# EAGLE design Ali CC Regolabile OpAmp(NPN) (EAGLE 7.2.0)
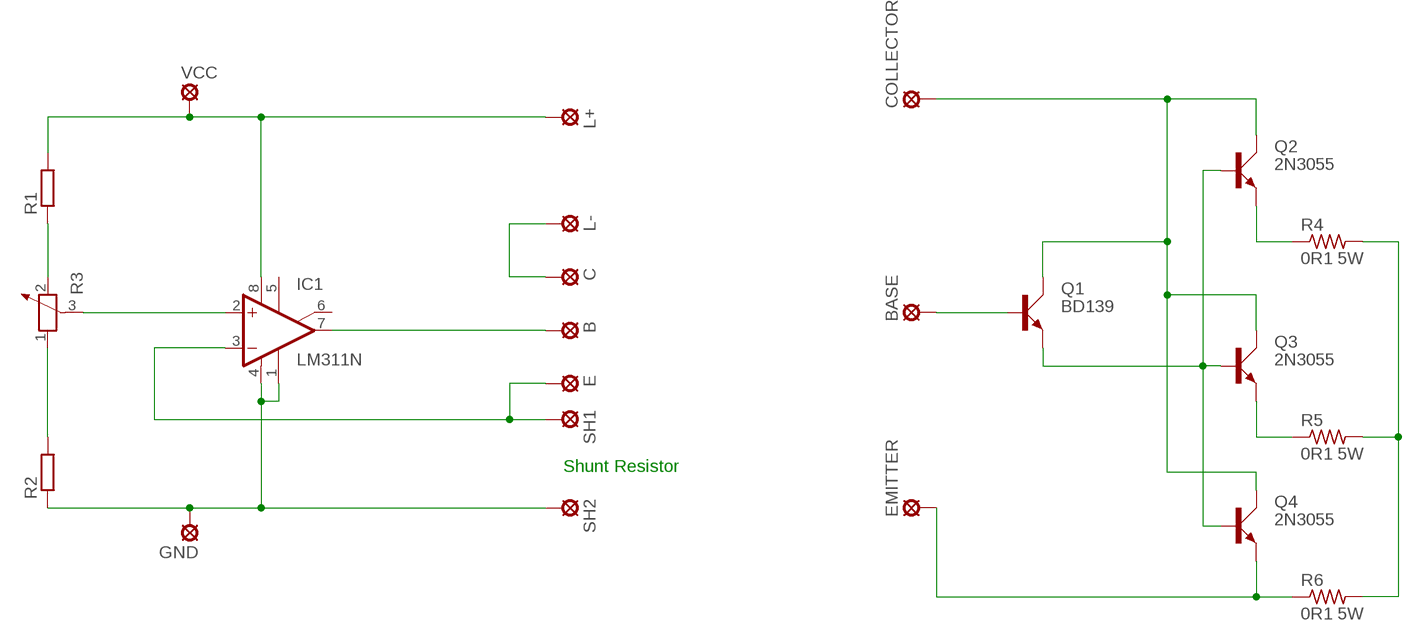
[diagram p0: schematic, sheet 1]

## Parts
B  SE14  [SE14]
BASE  SE14  [SE14]
C  SE14  [SE14]
COLLECTOR  SE14  [SE14]
E  SE14  [SE14]
EMITTER  SE14  [SE14]
GND  SE14  [SE14]
IC1  LM311N  [DIL08]
L+  SE14  [SE14]
L-  SE14  [SE14]
Q1  BD139  [TO126AV]
Q2  2N3055  [TO3A]
Q3  2N3055  [TO3A]
Q4  2N3055  [TO3A]
R1  R-EU_0207/12  [0207/12]
R2  R-EU_0207/12  [0207/12]
R3  POTENTIOMETER_PT-10  [PT-10]
R4  0R1 5W  R-US_0617/22  [0617/22]
R5  0R1 5W  R-US_0617/22  [0617/22]
R6  0R1 5W  R-US_0617/22  [0617/22]
SH1  SE14  [SE14]
SH2  SE14  [SE14]
VCC  SE14  [SE14]

## Nets
N$1: B.MP IC1.7(OUT)
N$2: E.MP IC1.3(-IN) SH1.MP
N$3: C.MP L-.MP
N$4: IC1.8(V+) L+.MP R1.2 VCC.MP
N$5: R1.1 R3.2
N$6: R2.2 R3.1
N$8: IC1.2(+IN) R3.3
N$9: GND.MP IC1.1(GND) IC1.4(V-) R2.1 SH2.MP
N$10: Q3.E R5.1
N$11: EMITTER.MP Q4.E R6.1
N$13: COLLECTOR.MP Q1.C Q2.C Q2.C1(C) Q3.C Q3.C1(C) Q4.C Q4.C1(C)
N$14: Q2.E R4.1
N$16: R4.2 R5.2 R6.2
N$17: Q1.E Q2.B Q3.B Q4.B
N$19: BASE.MP Q1.B
Unconnected: IC1.5(ON) IC1.6(ON/STR)

## Notes on the sheet
- Shunt Resistor

## Library data of the parts
B BASE C COLLECTOR E EMITTER GND L+ L- SH1 SH2 VCC = solpad:SE14: SOLDER PAD E1553, drill 1,4mm, distributor Buerklin, 07F820
IC1 = linear:LM311: COMPARATOR
Q1 = transistor-power:BD139: NPN TRANSISTOR
Q2-Q4 = transistor-power:2N3055: NPN TRANSISTOR
R1 R2 = rcl:R-EU_: RESISTOR, European symbol
R3 = rcl:POTENTIOMETER_: Potentiometer
R4-R6 = rcl:R-US_: RESISTOR, American symbol

## Board
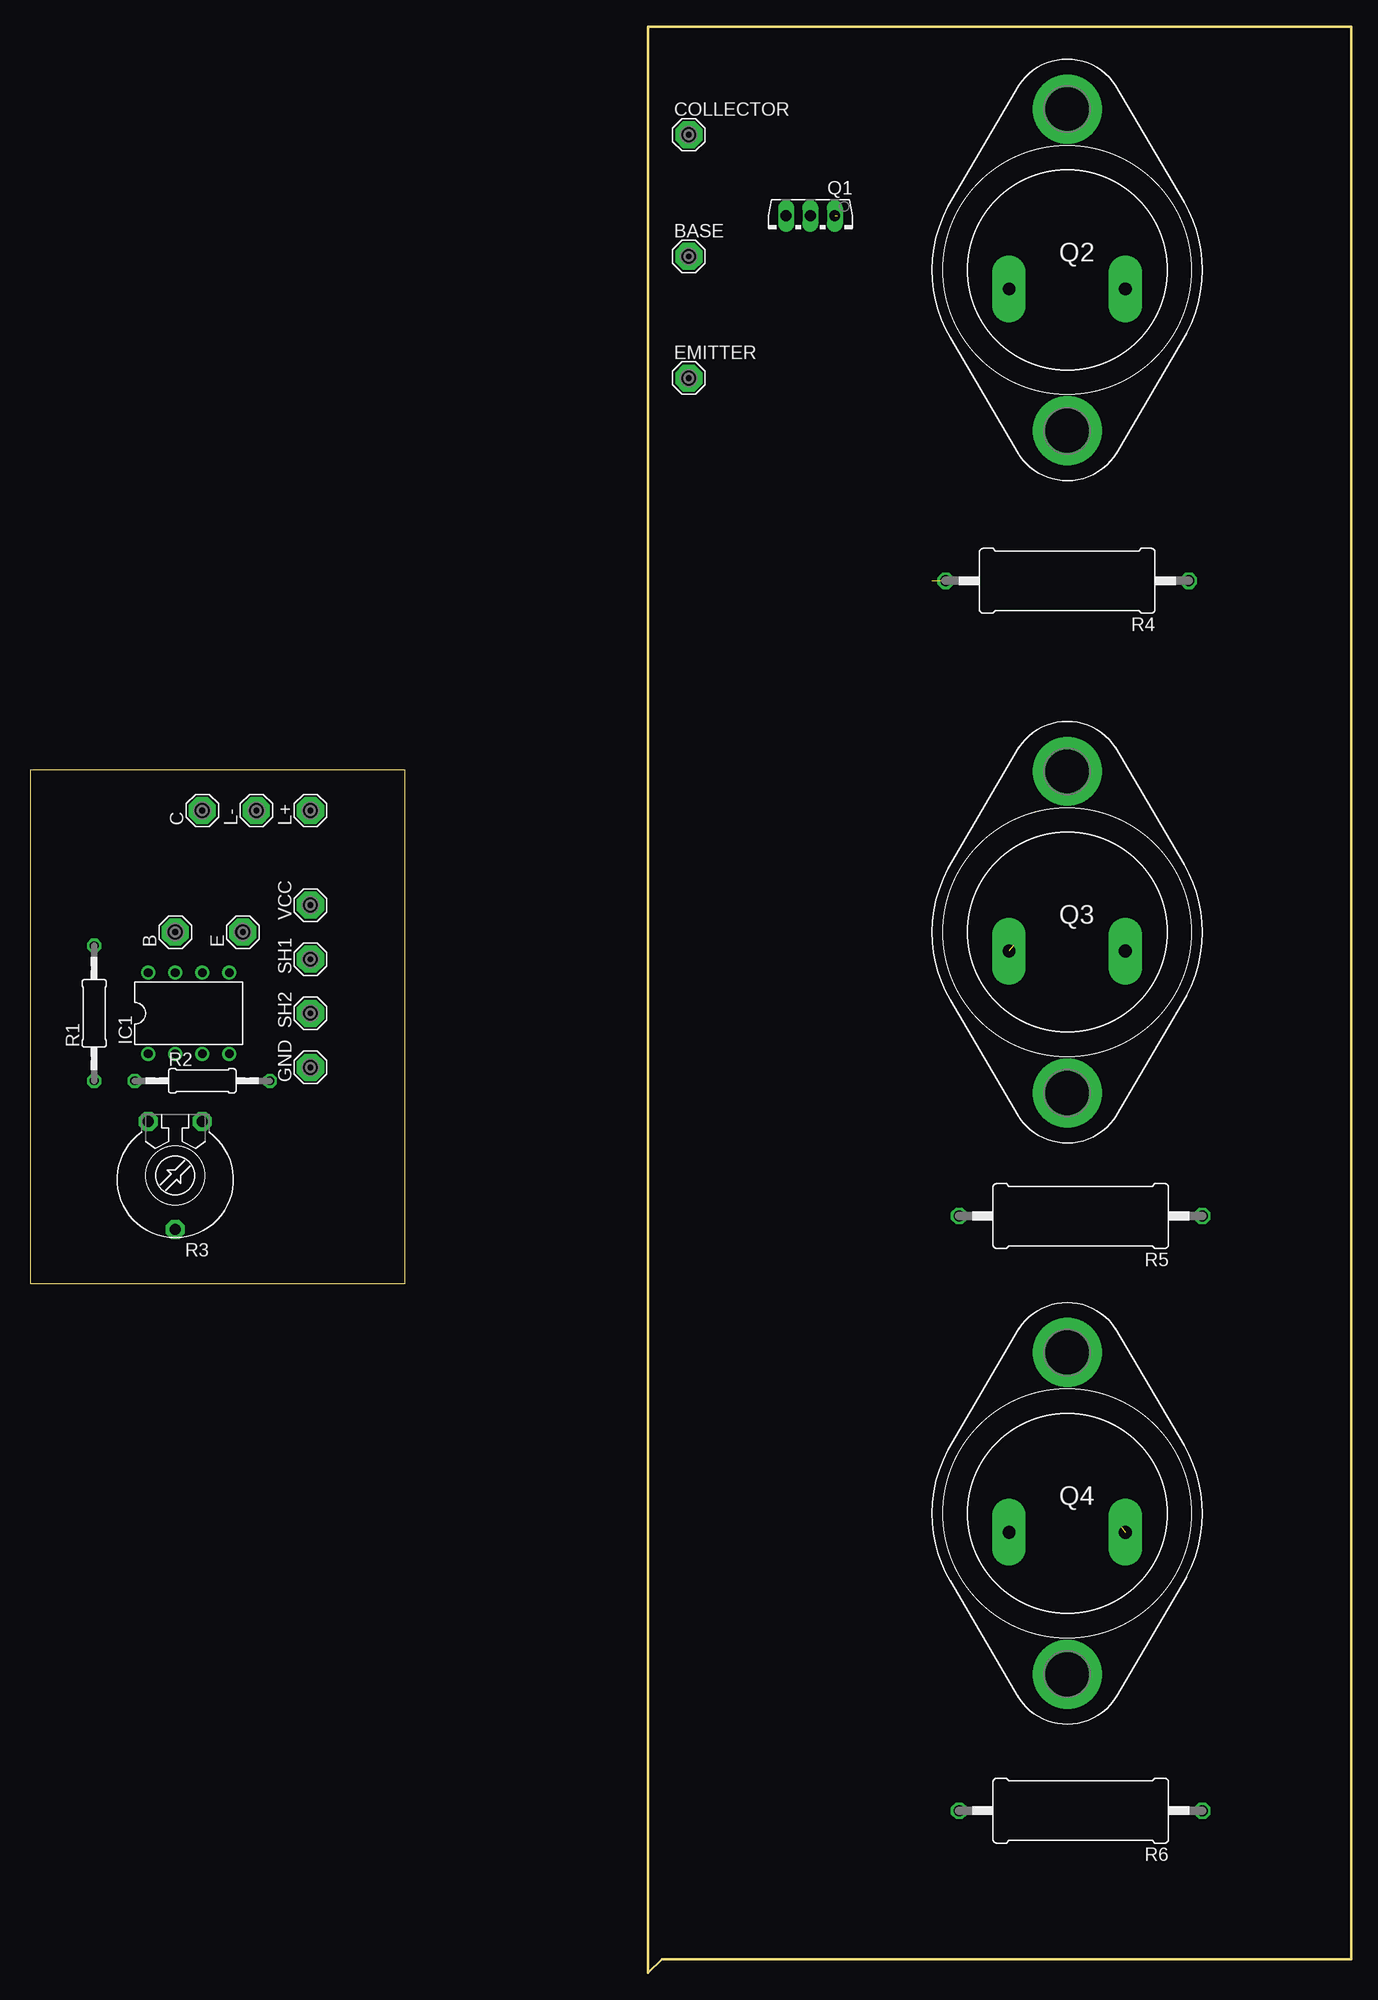
[diagram p1: board, top side]
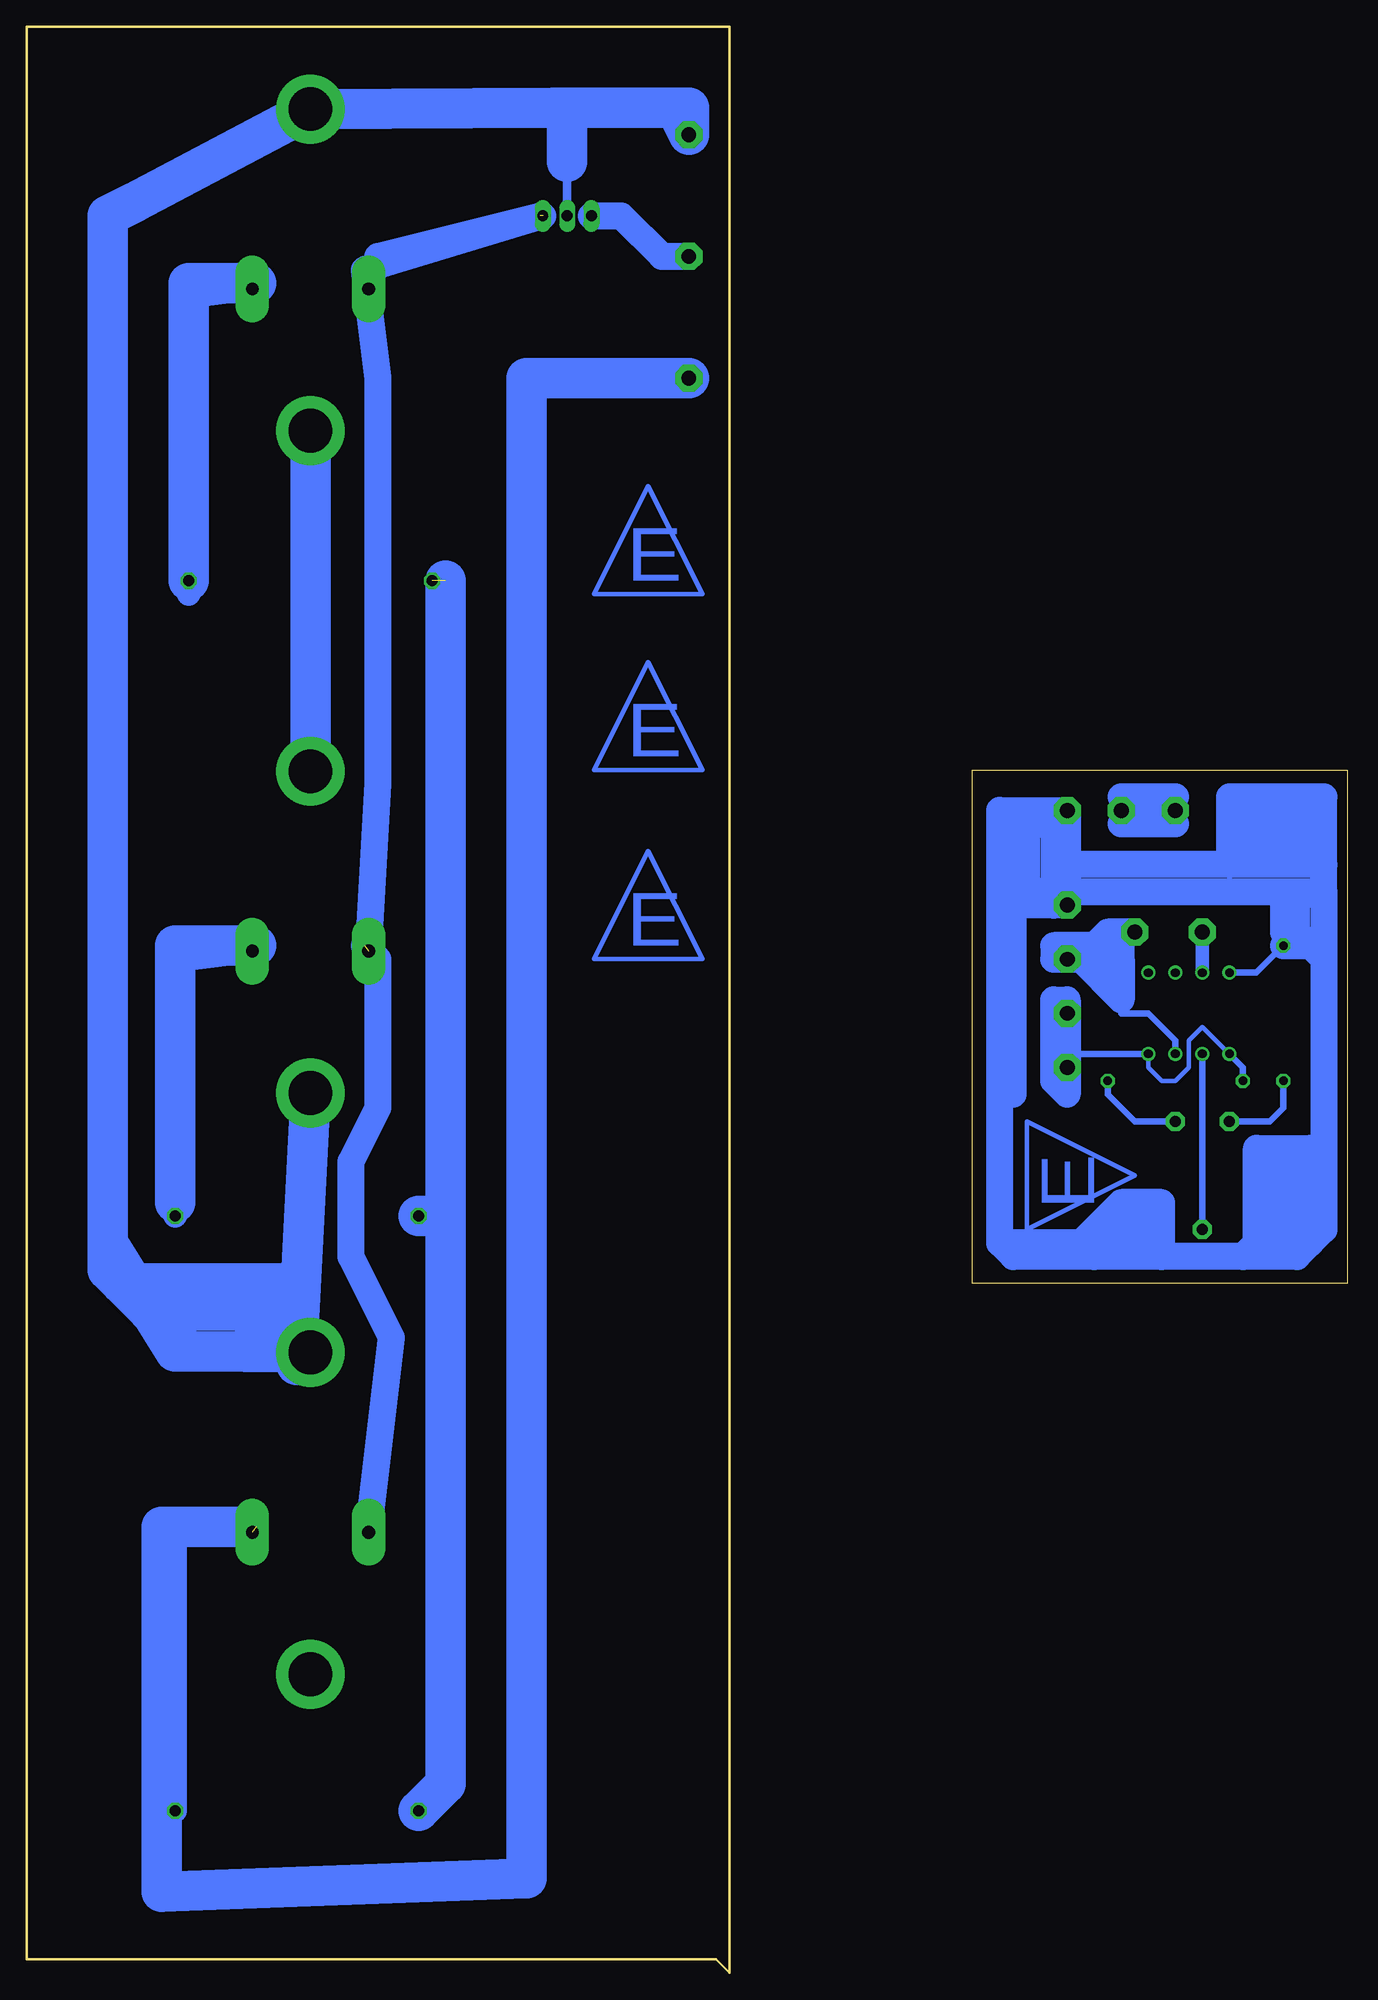
[diagram p2: board, bottom side, seen from below]

Size 124.13 x 182.88 mm. Coordinates in mm from the lower left corner, seen from the top.
Outline: 35.23,64.77 35.23,113.01 0,113.01 0,64.77 35.23,64.77
Outline: 124.13,182.88 58.09,182.88 58.09,0 59.36,1.27 124.13,1.27 124.13,182.88
Copper layers (1*16): Top 0.035mm / dielectric 1.5mm / Bottom 0.035mm
Design rules "default": minimum track width 10mil, minimum drill 24mil, track to track 8mil, track to pad 8mil, pad to pad 8mil, via to via 8mil, smd to smd 8mil, copper to edge 40mil, drill to drill 8mil, minimum pad ring 10mil, minimum via ring 8mil, stop-mask expansion 4mil, vias tented up to drill 0mil, thermal gap 10mil

### Footprints (pad centres in the part's own frame; a part is rotated, then mirrored left to right if it is on the bottom)
SE14 = drill 1.397 pad 2.54 octagon: MP 0,0
DIL08 = drill 0.813 pad 1.27: 1 -3.81,-3.81; 2 -1.27,-3.81; 3 1.27,-3.81; 4 3.81,-3.81; 5 3.81,3.81; 6 1.27,3.81; 7 -1.27,3.81; 8 -3.81,3.81
TO126AV = drill 1.016 long: B 2.286,-1.27; C 0,-1.27; E -2.286,-1.27
TO3A = drill 1.194 pad 3.15 long: B -1.778,5.461; E -1.778,-5.461 | drill 4.115 pad 6.477: C 15.113,0; C1 -15.113,0
0207/12 = drill 0.813 octagon: 1 -6.35,0; 2 6.35,0
PT-10 = drill 1.016 pad 1.778 octagon: 1 -2.54,-5.08; 2 2.54,-5.08; 3 0,5.08
0617/22 = drill 1.016 octagon: 1 -11.43,0; 2 11.43,0

### Placement (x,y rotation side)
B  13.64,97.79 90 top
BASE  61.9,161.29 0 top
C  16.18,109.22 90 top
COLLECTOR  61.9,172.72 0 top
E  19.99,97.79 90 top
EMITTER  61.9,149.86 0 top
GND  26.34,85.09 90 top
IC1  14.91,90.17 0 top
L+  26.34,109.22 90 top
L-  21.26,109.22 90 top
Q1  73.33,163.83 180 top
Q2  97.46,160.02 90 top
Q3  97.46,97.79 90 top
Q4  97.46,43.18 90 top
R1  6.02,90.17 90 top
R2  16.18,83.82 0 top
R3  13.64,74.93 180 top
R4  97.46,130.81 180 top
R5  98.73,71.12 180 top
R6  98.73,15.24 180 top
SH1  26.34,95.25 90 top
SH2  26.34,90.17 90 top
U$1  [LOGO]  22.53,87.63 90 top
U$2  [LOGO]  78.41,137.16 0 top
U$3  [LOGO]  78.41,120.65 0 top
U$4  [LOGO]  78.41,102.87 0 top
VCC  26.34,100.33 90 top

### Tracks (layer width: path | path; a pad name or v marks a point on that pad's centre or on a via)
N$1
  Bottom 1.27: IC1.7 B.MP
N$2
  Bottom 0.61: IC1.3 16.18,87.63 18.72,90.17 21.26,90.17 21.26,91.44
  Bottom 2.54: E.MP 21.26,97.79 | 21.26,97.79 22.53,97.79 23.8,96.52 | 23.8,96.52 25.07,95.25 | 25.07,95.25 SH1.MP 27.61,95.25 27.61,96.52 23.8,96.52 | 25.07,95.25 21.26,95.25 | 21.26,95.25 21.26,97.79 | 21.26,95.25 21.26,91.44 25.07,95.25
N$3
  Bottom 2.54: L-.MP C.MP
N$4
  Bottom 0.61: R1.2 8.56,93.98 IC1.8
  Bottom 2.54: R1.2 2.21,96.52 | 2.21,96.52 2.21,95.25 | 2.21,95.25 2.21,69.85 3.48,68.58 | 3.48,68.58 4.75,67.31 9.83,67.31 | 9.83,67.31 17.45,67.31 | 17.45,67.31 23.8,67.31 | 23.8,67.31 31.42,67.31 32.69,68.58 32.69,109.22 L+.MP 26.34,104.14 | 26.34,104.14 26.34,101.6 | 26.34,101.6 VCC.MP 27.61,100.33 | 27.61,100.33 31.42,100.33 | 31.42,100.33 31.42,107.95 27.61,107.95 27.61,100.33 | 27.61,100.33 28.88,101.6 30.15,101.6 30.15,106.68 | 26.34,101.6 2.21,101.6 | 2.21,101.6 2.21,96.52 | 2.21,95.25 4.75,97.79 4.75,100.33 6.02,100.33 6.02,97.79 | 2.21,101.6 2.21,104.14 | 2.21,104.14 11.1,104.14 | 11.1,104.14 26.34,104.14 | 17.45,67.31 17.45,72.39 18.72,72.39 | 18.72,72.39 22.53,68.58 | 23.8,67.31 22.53,68.58 | 22.53,68.58 18.72,68.58 18.72,69.85 | 22.53,68.58 25.07,68.58 | 25.07,68.58 22.53,71.12 | 22.53,71.12 18.72,71.12 18.72,72.39 | 18.72,72.39 21.26,72.39 22.53,71.12 | 25.07,68.58 31.42,68.58 | 31.42,82.55 31.42,100.33 | 2.21,104.14 2.21,110.49 11.1,110.49 11.1,104.14 | 11.1,104.14 8.56,106.68 8.56,109.22 3.48,109.22 3.48,105.41 7.29,105.41 7.29,106.68 4.75,106.68 | 9.83,67.31 8.56,68.58 8.56,77.47 3.48,77.47 3.48,68.58 | 3.48,68.58 6.02,68.58 | 6.02,68.58 7.29,68.58 7.29,76.2 4.75,76.2 6.02,74.93 6.02,68.58
N$5
  Bottom 0.61: R3.2 7.29,80.01 6.02,81.28 R1.1
N$6
  Bottom 0.61: R3.1 19.99,80.01 22.53,82.55 R2.2
N$8
  Bottom 0.61: R3.3 IC1.2
N$9
  Bottom 0.406: IC1.1 13.64,88.9 14.91,87.63 14.91,85.09 16.18,83.82 17.45,83.82 18.72,85.09 IC1.4
  Bottom 0.61: R2.1 9.83,85.09 IC1.1 | GND.MP 26.34,86.36 IC1.4
  Bottom 2.54: SH2.MP 26.34,86.36
N$10
  Bottom 2.184: 108.89,95.25 Q3.E 110.16,96.52 | R5.1 110.16,72.39
  Bottom 3.81: 102.54,96.52 110.16,96.52 110.16,72.39
N$11  (1 unrouted)
  Bottom 2.184: R6.1 110.16,41.91 103.81,41.91 102.54,41.91
  Bottom 3.81: EMITTER.MP 77.14,149.86 77.14,8.89 111.43,7.62 111.43,41.91 103.81,41.91
N$13
  Bottom 0.813: Q1.C 73.33,171.45
  Bottom 3.81: 98.73,64.77 115.24,64.77 112.7,62.23 100,62.23 103.81,58.42 108.89,58.42 116.51,66.04 116.51,68.58 | Q2.C1 Q3.C | Q3.C1 98.73,57.15 | 116.51,68.58 116.51,165.1 113.97,166.37 Q2.C 74.6,175.25 | 116.51,68.58 110.16,58.42 Q4.C | 74.6,175.25 73.33,175.26 | 73.33,175.26 73.33,171.45 73.33,170.18 | 74.6,175.25 63.17,175.26 COLLECTOR.MP 61.9,175.26 73.33,175.26
N$14
  Bottom 2.184: Q2.E 108.89,157.48 R4.1 108.89,129.54
  Bottom 3.81: 102.54,158.75 108.89,158.75 R4.1
N$16  (1 unrouted)
  Bottom 3.81: R6.2 84.76,17.78 84.76,71.12 | R5.2 84.76,71.12 | 84.76,71.12 84.76,130.81
N$17  (2 unrouted)
  Bottom 2.54: Q4.B 89.84,59.69 93.65,67.31 93.65,76.2 91.11,81.28 91.11,95.25 92.38,96.52 | Q3.B 91.11,111.76 91.11,149.86 92.38,160.02 Q1.E | Q2.B 91.11,161.29 75.87,165.1
N$19
  Bottom 2.54: Q1.B 68.25,165.1 64.44,161.29 BASE.MP
N$21
  Bottom 2.54: 16.18,107.95 21.26,107.95
N$22
  Bottom 2.54: 16.18,110.49 21.26,110.49
N$23
  Bottom 2.54: 26.34,82.55 27.61,83.82 27.61,91.44 26.34,91.44 26.34,82.55